# EAGLE design p2cgb-001 (EAGLE 9.5.2)
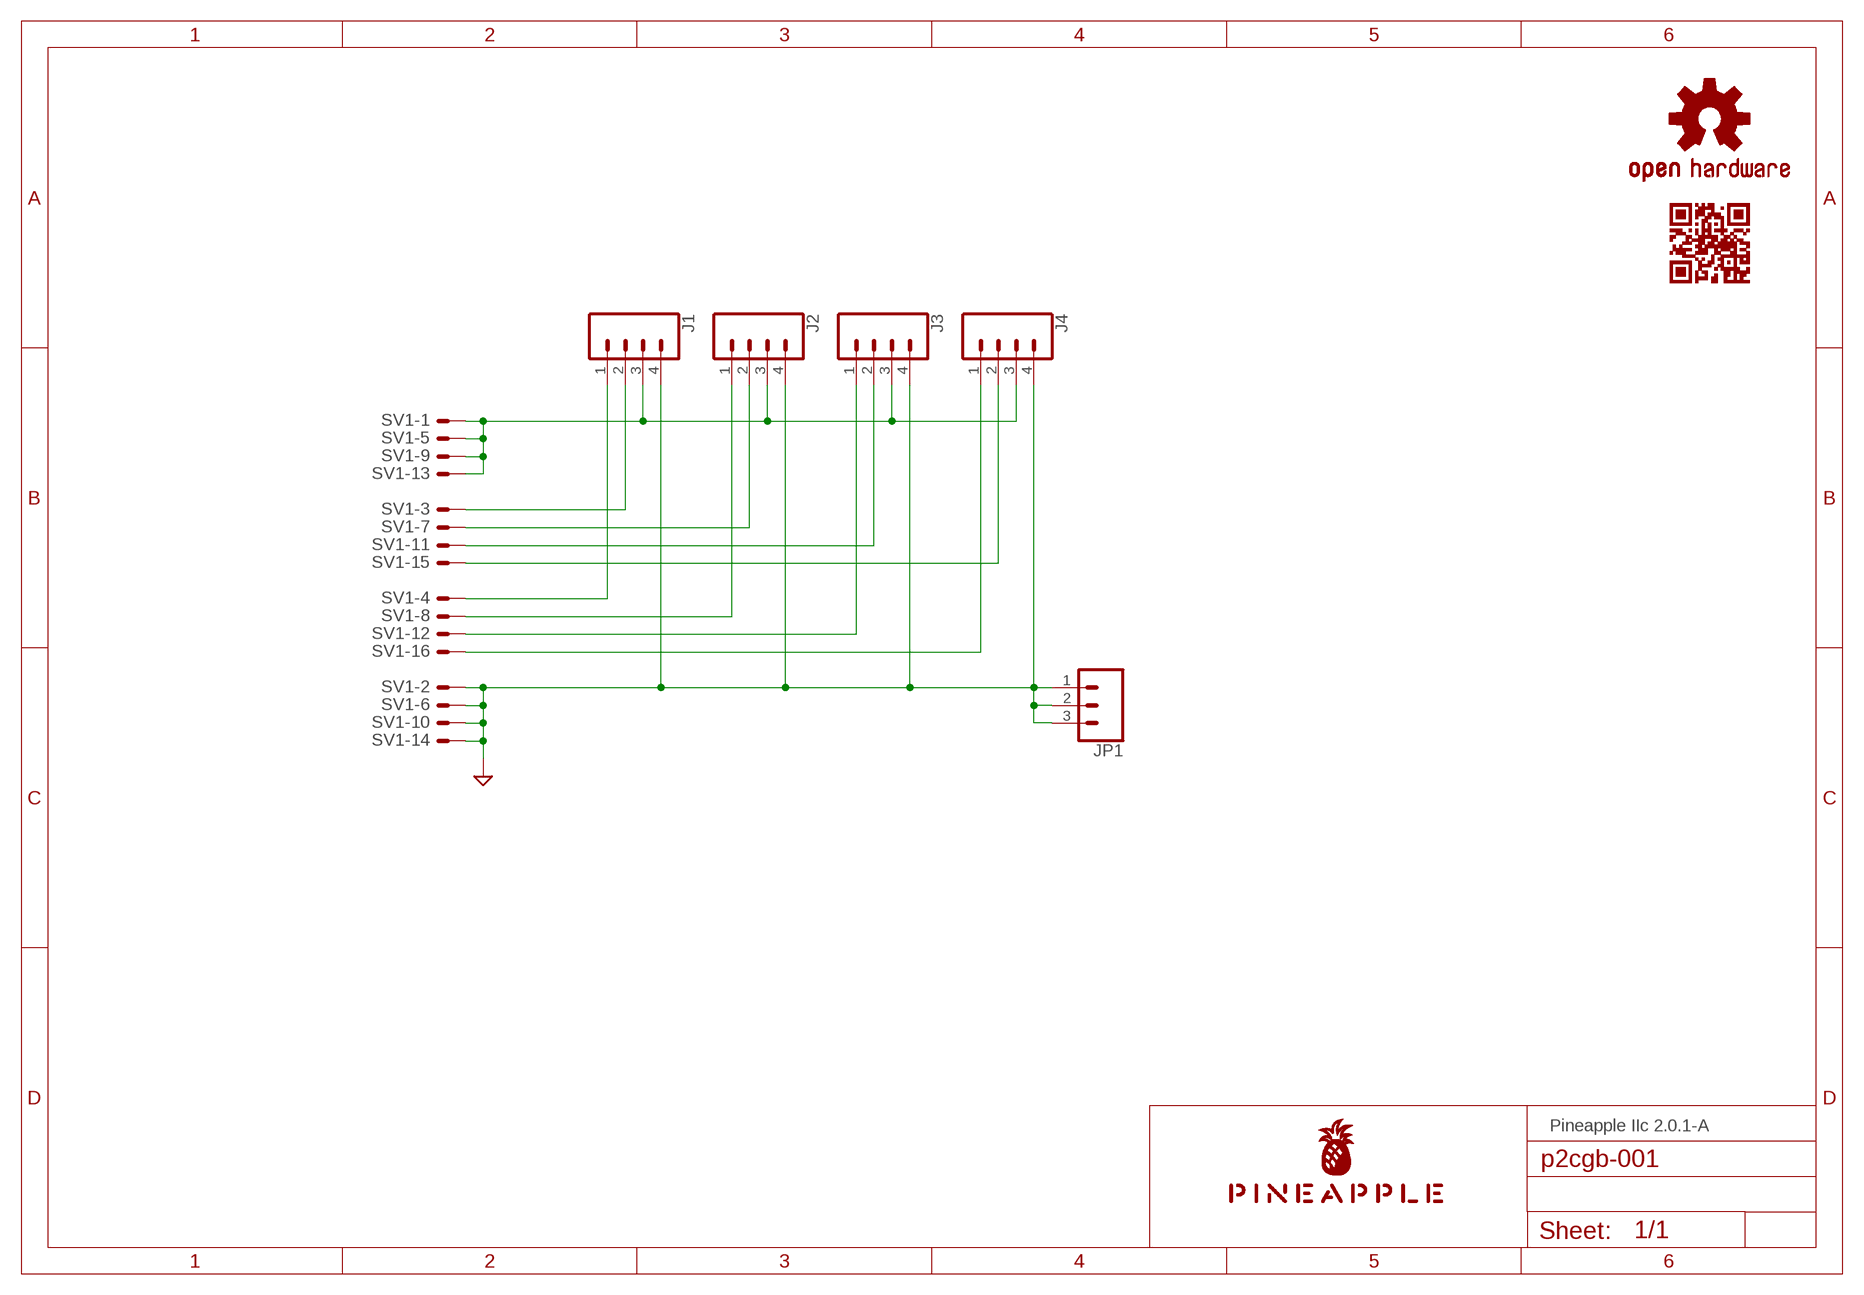
[diagram p0: schematic, sheet 1]

## Parts
J1  CONN_04JST-PTH  [JST-4-PTH]
J2  CONN_04JST-PTH  [JST-4-PTH]
J3  CONN_04JST-PTH  [JST-4-PTH]
J4  CONN_04JST-PTH  [JST-4-PTH]
JP1  CONN_03  [1X03]
LOGO1  OSHW-LOGOS-COPPER  [OSHW-LOGO-S_COPPER]
SV1  ML16LE  [ML16L]
U$1  PINEAPPLE450_SILK  [PINEAPPLE450_SILK]
U$4  CARDQRCODE450_SILK  [CARDQRCODE450_SILK]

## Nets
GND [ground]: J1.4 J2.4 J3.4 J4.4 JP1.1 JP1.2 JP1.3 SV1.2 SV1.6 SV1.10 SV1.14
N$1: J1.1 SV1.4
N$2: J2.1 SV1.8
N$3: J3.1 SV1.12
N$4: J4.1 SV1.16
N$5: J1.2 SV1.3
N$6: J2.2 SV1.7
N$7: J3.2 SV1.11
N$9: J4.2 SV1.15
VCC [power1]: J1.3 J2.3 J3.3 J4.3 SV1.1 SV1.5 SV1.9 SV1.13

## Notes on the sheet
- Pineapple IIc 2.0.1-A

## Library data of the parts
J1-J4 = SparkFun-Connectors:CONN_04: Multi connection point. Often used as Generic Header-pin footprint for 0.1 inch spaced/style header connections On any of the 0.1 inch spaced packages, you can populate with these: Break Away Headers - Straight <https://www.sparkfun.com/products/116> (PRT-00116) Break Away Male Headers - Right Angle <https://www.sparkfun.com/products/553> (PRT-00553) Female Headers <https://www.sparkfun.com/products/115> (PRT-00115) Break Away Headers - Machine Pin <https://www.sparkfun.com/products/117> (PRT-00117) Break Away Female Headers - Swiss Machine Pin <https://www.sparkfun.com/products/743> (PRT-00743) For SCREWTERMINALS and SPRING TERMINALS visit here: Screw Terimnals on SparkFun.com <https://www.sparkfun.com/search/results?term=Screw+Terminals> (5mm/3.5mm/2.54mm spacing) This device is also useful as a general connection point to wire up your design to another part of your project. Our various solder wires solder well into these plated through hole pads. Hook-Up Wire - Assortment (Stranded, 22 AWG) <https://www.sparkfun.com/products/11375> (PRT-11375) Hook-Up Wire - Assortment (Solid Core, 22 AWG) <https://www.sparkfun.com/products/11367> (PRT-11367) View the entire wire category on our website here <https://www.sparkfun.com/categories/141> Special notes: Molex polarized connector foot print use with SKU : PRT-08231 with associated crimp pins and housings. 1MM SMD Version SKU: PRT-10208; PROD_ID: WIRE-13531; SF_ID: PRT-09916
JP1 = SparkFun-Connectors:CONN_03: Multi connection point. Often used as Generic Header-pin footprint for 0.1 inch spaced/style header connections On any of the 0.1 inch spaced packages, you can populate with these: Break Away Headers - Straight <https://www.sparkfun.com/products/116> (PRT-00116) Break Away Male Headers - Right Angle <https://www.sparkfun.com/products/553> (PRT-00553) Female Headers <https://www.sparkfun.com/products/115> (PRT-00115) Break Away Headers - Machine Pin <https://www.sparkfun.com/products/117> (PRT-00117) Break Away Female Headers - Swiss Machine Pin <https://www.sparkfun.com/products/743> (PRT-00743) Stackable Header - 3 Pin (Female, 0.1") <https://www.sparkfun.com/products/13875> (PRT-13875) For SCREWTERMINALS and SPRING TERMINALS visit here: Screw Terimnals on SparkFun.com <https://www.sparkfun.com/search/results?term=Screw+Terminals> (5mm/3.5mm/2.54mm spacing) This device is also useful as a general connection point to wire up your design to another part of your project. Our various solder wires solder well into these plated through hole pads. Hook-Up Wire - Assortment (Stranded, 22 AWG) <https://www.sparkfun.com/products/11375> (PRT-11375) Hook-Up Wire - Assortment (Solid Core, 22 AWG) <https://www.sparkfun.com/products/11367> (PRT-11367) View the entire wire category on our website here <https://www.sparkfun.com/categories/141> Special notes: Molex polarized connector foot print use with SKU : PRT-08232 with associated crimp pins and housings.
LOGO1 = SparkFun-Aesthetics:OSHW-LOGO: Open-Source Hardware (OSHW) Logo This logo indicates the piece of hardware it is found on incorporates a OSHW license and/or adheres to the definition of open source hardware found here: http://freedomdefined.org/OSHW
SV1 = con-ml:ML16LE: HARTING; OC_FARNELL: unknown; OC_NEWARK: unknown
U$1 = pineapple:PINEAPPLE450_SILK
U$4 = pineapple:CARDQRCODE450_SILK

## Net classes
0 default: width 0.152 mm, drill 0.305 mm, clearance 0.152 mm
1 ground: width 0.61 mm, drill 0.305 mm, clearance 0.152 mm
2 power1: width 0.61 mm, drill 0.305 mm, clearance 0.152 mm
3 power2: width 0.305 mm, drill 0.305 mm, clearance 0.152 mm

## Board
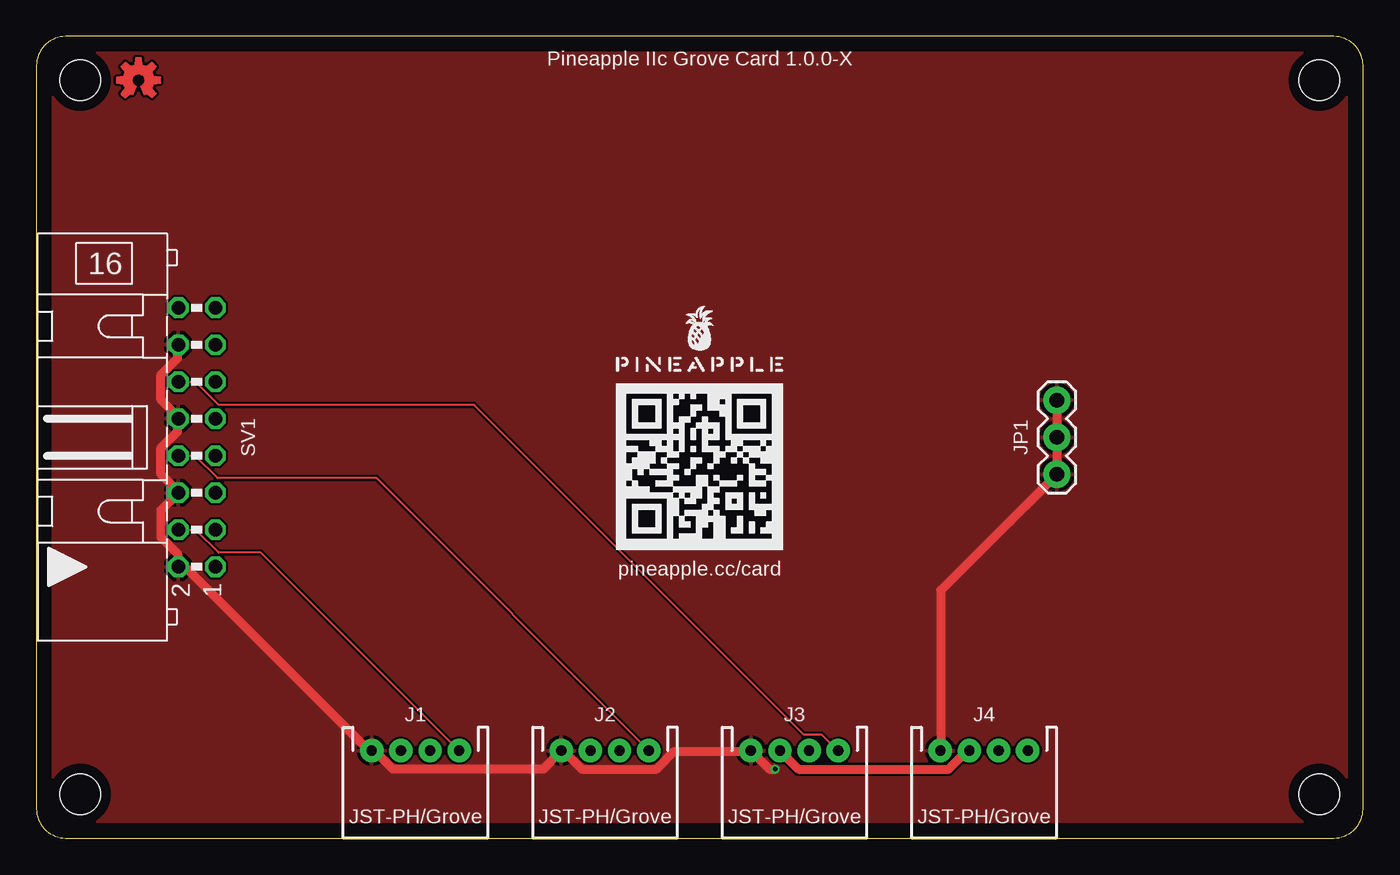
[diagram p1: board, top side]
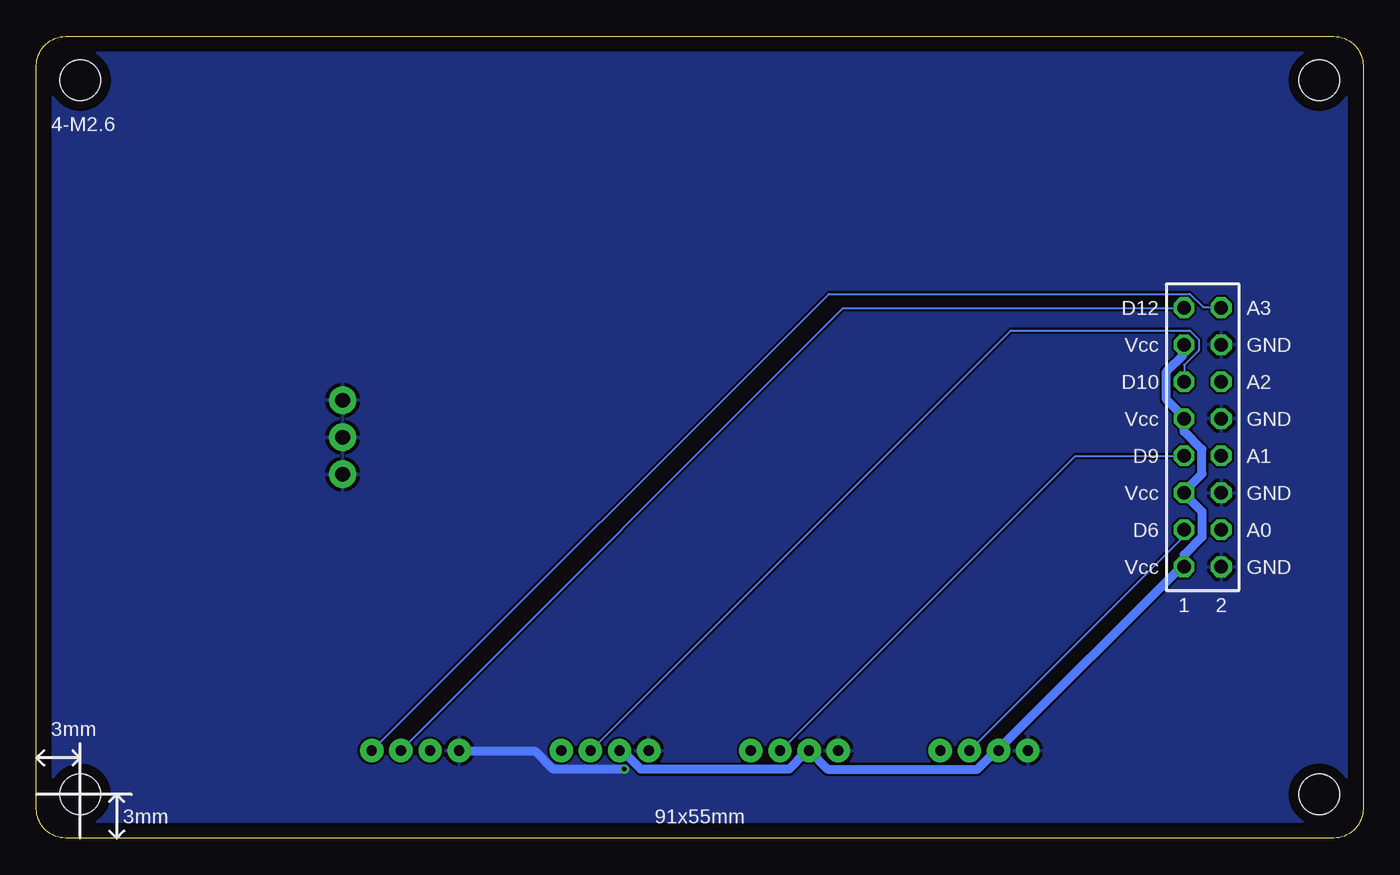
[diagram p2: board, bottom side, seen from below]

Size 91 x 55 mm. Coordinates in mm from the lower left corner, seen from the top.
Outline: 0,53 0,2 arc90 2,0 89,0 arc90 91,2 91,53 arc90 89,55 2,55 arc90 0,53
Copper layers (1*16): Top 0.035mm / dielectric 1.5mm / Bottom 0.035mm
Design rules "SeeedStudio_2layer_DRU_no_angle_20140221": minimum track width 6mil, minimum drill 12mil, track to track 6mil, track to pad 6mil, pad to pad 6mil, via to via 6mil, smd to smd 0mil, copper to edge 10mil, drill to drill 10mil, minimum pad ring 10mil, minimum via ring 6mil, stop-mask expansion 2mil, vias tented up to drill 100mil, thermal gap 10mil
Holes 2.8 mm at 3,3 3,52 88,52 88,3
tRestrict: area 0,0 to 91,1; area 90,0 to 91,55; area 0,54 to 91,55; area 0,0 to 1,55; area 1,50 to 5,54; area 1,1 to 5,5; area 86,1 to 90,5; area 86,50 to 90,54; area 40,20 to 51,31
bRestrict: area 0,0 to 91,1; area 90,0 to 91,55; area 0,54 to 91,55; area 0,0 to 1,55; area 86,50 to 90,54; area 86,1 to 90,5; area 1,50 to 5,54; area 1,1 to 5,5
vRestrict: area 40,17.5 to 51,19

### Footprints (pad centres in the part's own frame; a part is rotated, then mirrored left to right if it is on the bottom)
JST-4-PTH = drill 0.7 pad 1.6: 1 -3,0; 2 -1,0; 3 1,0; 4 3,0
1X03 = drill 1.016 pad 1.88: 1 0,0; 2 2.54,0; 3 5.08,0
ML16L = drill 0.914 octagon: 1 -8.89,-1.27; 2 -8.89,1.27; 3 -6.35,-1.27; 4 -6.35,1.27; 5 -3.81,-1.27; 6 -3.81,1.27; 7 -1.27,-1.27; 8 -1.27,1.27; 9 1.27,-1.27; 10 1.27,1.27; 11 3.81,-1.27; 12 3.81,1.27; 13 6.35,-1.27; 14 6.35,1.27; 15 8.89,-1.27; 16 8.89,1.27

### Placement (x,y rotation side)
J1  26,6 180 top
J2  39,6 180 top
J3  52,6 180 top
J4  65,6 180 top
JP1  70,24.96 90 top
LOGO1  7,52 0 top
SV1  11,27.5 90 top
U$1  45.5,32 0 top
U$4  45.5,25.5 0 top

### Tracks (layer width: path | path; a pad name or v marks a point on that pad's centre or on a via)
GND  (via drill 0.3)
  Top 0.61: J4.4 62.03,6.02 62.03,16.99 69.95,24.92 JP1.1 70.03,25.22 70.03,27.43 JP1.2 70.03,27.81 70.03,30.02 JP1.3 | SV1.14 9.68,33.83 9.68,32.92 8.53,31.77 8.53,30.1 9.6,29.03 SV1.10 9.68,28.73 9.68,27.89 8.53,26.75 8.53,24.99 9.6,23.93 SV1.6 9.68,23.62 8.53,22.48 8.53,20.65 9.68,19.51 9.68,18.67 SV1.2 9.98,18.44 10.36,18.44 22.71,6.1 J1.4 23.01,5.94 23.24,5.94 24.46,4.72 34.75,4.72 35.97,5.94 J2.4 36.27,5.87 37.41,4.72 42.52,4.72 43.74,5.94 49,5.94 J3.4 49.23,5.79 50.29,4.72 v50.67,4.72
  Bottom 0.61: v50.67,4.72 55.55,4.72 56.77,5.94 61.95,5.94 J4.4
  pour Top: -1,-1 92,-1 92,56 -1,56
  pour Bottom: -2,-2 93,-2 93,57 -2,57
N$1
  Top 0.152: SV1.4 9.75,21.11 10.97,21.11 12.5,19.58 15.39,19.58 28.96,6.02 J1.1
N$2
  Top 0.152: SV1.8 9.75,26.21 10.9,26.21 12.42,24.69 23.32,24.69 41.99,6.02 J2.1
N$3
  Top 0.152: SV1.12 9.75,31.24 10.97,31.24 12.5,29.72 30.02,29.72 52.65,7.09 53.87,7.09 54.94,6.02 J3.1
N$4
  Bottom 0.152: SV1.16 9.75,36.42 10.97,36.42 11.89,37.34 36.65,37.34 67.97,6.02 J4.1
N$5
  Bottom 0.152: SV1.3 12.34,21.11 12.34,20.65 26.98,6.02 J1.2
N$6
  Bottom 0.152: SV1.7 12.34,26.21 19.74,26.21 39.93,6.02 J2.2
N$7
  Bottom 0.152: SV1.11 12.27,32.46 11.28,33.45 11.28,34.21 11.89,34.82 24.16,34.82 52.96,6.02 J3.2
N$9
  Bottom 0.152: SV1.15 12.34,36.35 35.66,36.35 65.99,6.02 J4.2
VCC
  Top 0.61: J4.3 63.93,5.94 63.78,5.94 62.56,4.72 52.27,4.72 51.05,5.94 J3.3
  Bottom 0.61: SV1.13 12.34,33.83 12.34,33.15 13.49,32 13.49,30.1 12.42,29.03 SV1.9 12.27,28.73 12.27,27.89 11.05,26.67 11.05,24.99 12.12,23.93 SV1.5 12.27,23.62 11.05,22.4 11.05,20.65 12.27,19.43 12.27,18.67 SV1.1 12.57,18.52 24.84,6.25 J1.3 25.07,5.94 25.22,5.94 26.44,4.72 36.73,4.72 37.95,5.94 J2.3 38.25,5.87 39.4,4.72 49.53,4.72 50.75,5.94 50.98,5.94 J3.3

### Text on the board
tNames: Pineapple IIc Grove Card 1.0.0-X | pineapple.cc/card | JST-PH/Grove | JST-PH/Grove | JST-PH/Grove | JST-PH/Grove
bNames: 4-M2.6 | A3 | D12 | GND | Vcc | A2 | D10 | GND | Vcc | A1 | D9 | GND | Vcc | A0 | D6 | GND | Vcc | 2 | 1 | 3mm | 91x55mm | 3mm